# EAGLE design OSO-MISC-20-030 PyRadio (EAGLE 9.6.2)
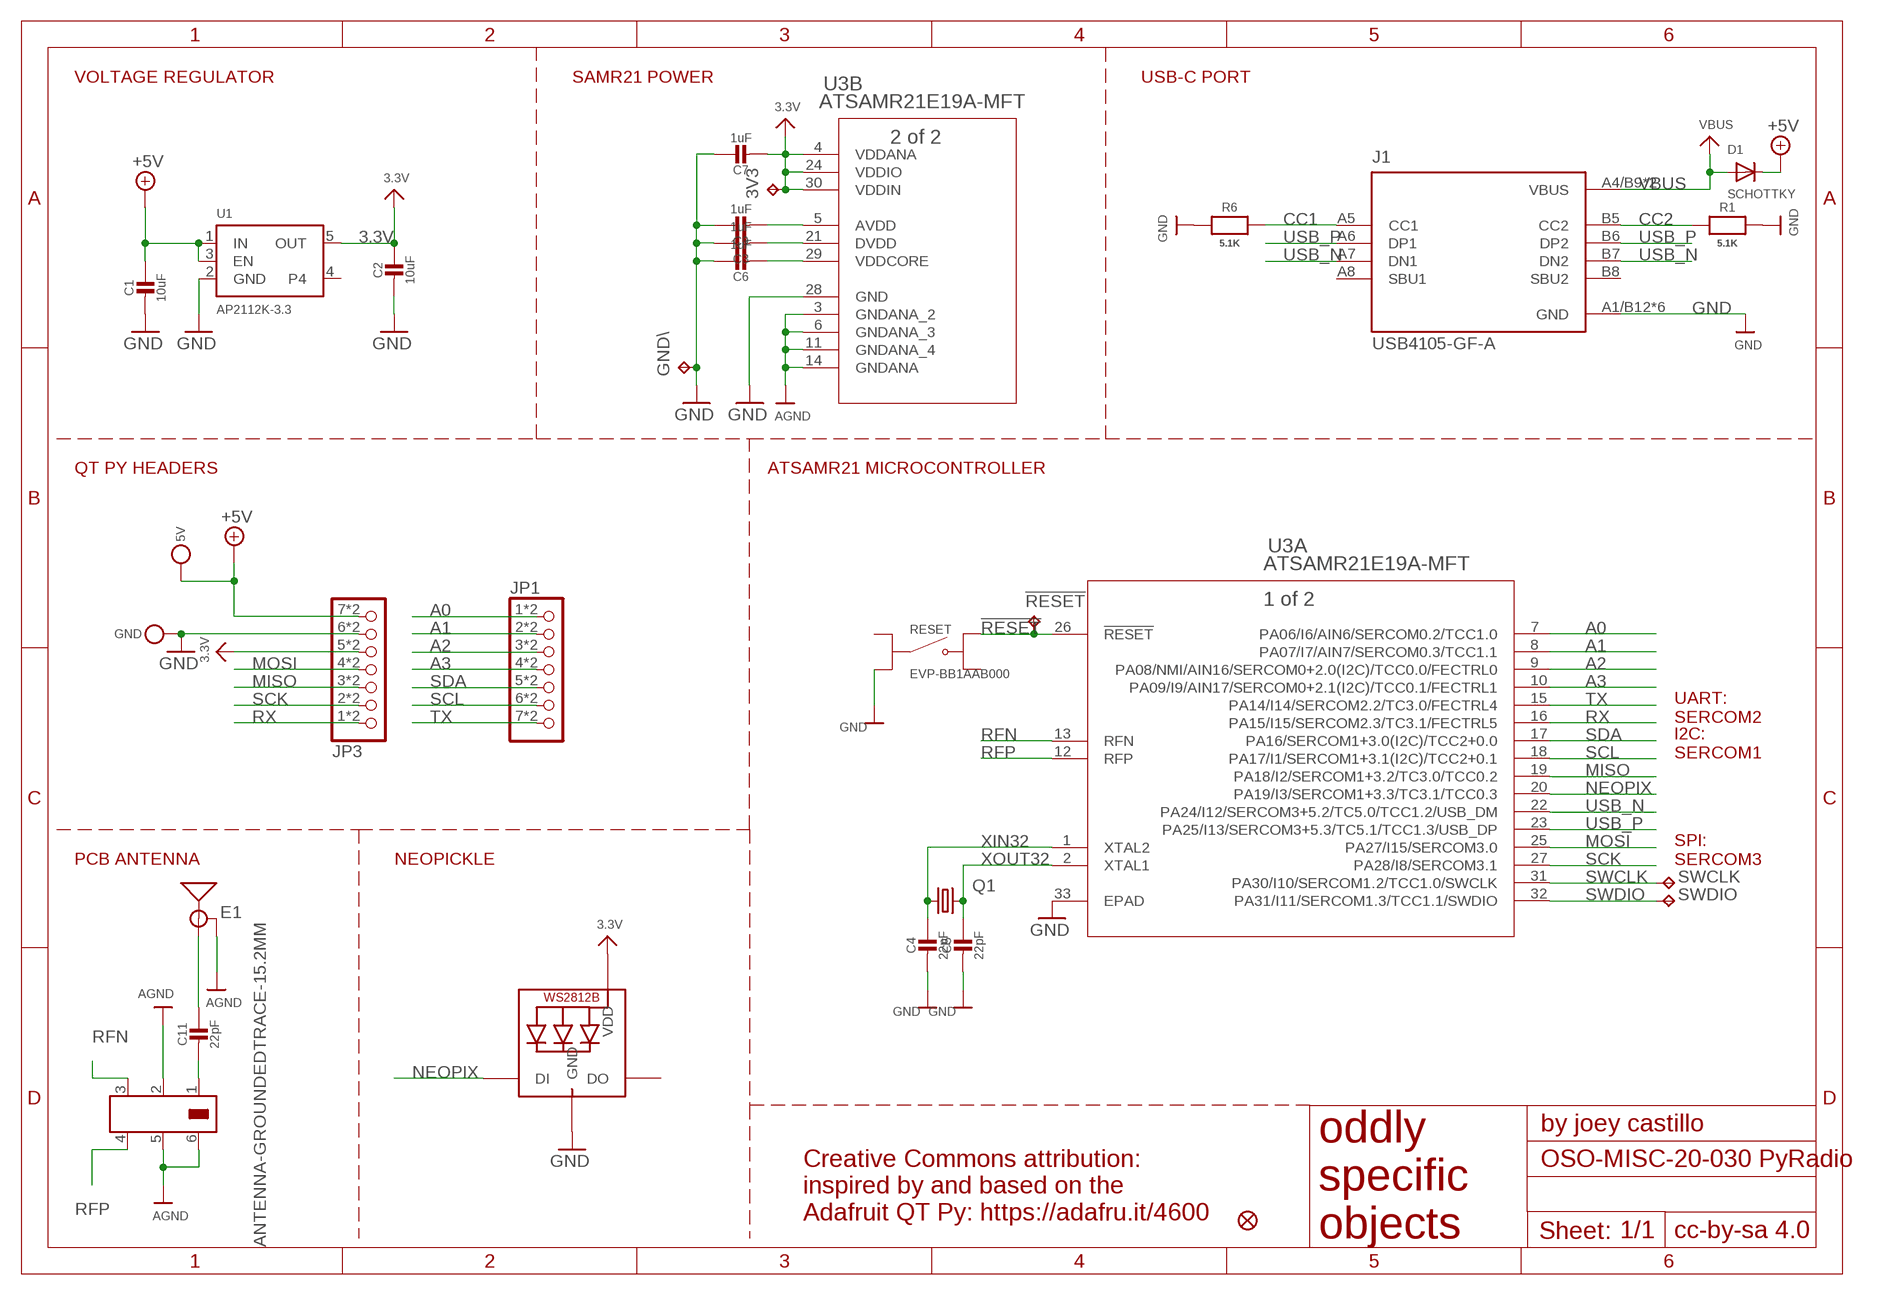
[diagram p0: schematic, sheet 1]

## Parts
3V3  TPTP20R  [TP20R]
5V  TESTPOINT_1X3  [TESTPOINT_RECT_1X3MM]
!RESET  TPTP20R  [TP20R]
BALUN  JOHANSON_2450BM15A0015E  [0805_BALUN]
C1  10uF  CAP_CERAMIC_0603MP  [_0603MP]
C2  10uF  CAP_CERAMIC_0603MP  [_0603MP]
C3  1uF  CAP_CERAMIC_0603MP  [_0603MP]
C4  22pF  CAP_CERAMIC_0603MP  [_0603MP]
C5  22pF  CAP_CERAMIC_0603MP  [_0603MP]
C6  1uF  CAP_CERAMIC_0603MP  [_0603MP]
C7  1uF  CAP_CERAMIC_0603MP  [_0603MP]
C9  1uF  CAP_CERAMIC_0603MP  [_0603MP]
C11  22pF  CAP_CERAMIC_0603MP  [_0603MP]
D1  SCHOTTKY  DIODESOD-323F  [SOD-323F]
E1  ANTENNA-GROUNDEDTRACE-15.2MM  [TRACE_ANTENNA_2.4GHZ_15.2MM]
GND  TESTPOINT_1X3  [TESTPOINT_RECT_1X3MM]
GND\  TPTP20R  [TP20R]
J1  USB4105-GF-A  [GCT_USB4105-GF-A]
JP1  HEADER-1X7_CASTEL  [1X07_CASTEL]
JP3  HEADER-1X7_CASTEL  [1X07_CASTEL]
LED  WS2812B_SK6805_1515  [SK6805_1515]
Q1  KX-7  [3.2X2.5_KX-7]
R1  5.1K  RESISTOR_0603MP  [_0603MP]
R6  5.1K  RESISTOR_0603MP  [_0603MP]
RESET  EVP-BB1AAB000  [SW_EVP-BB1AAB000]
SWCLK  TPTP20R  [TP20R]
SWDIO  TPTP20R  [TP20R]
U1  AP2112K-3.3  VREG_SOT23-5  [SOT23-5]
U3  ATSAMR21E19A-MFT  [QFN32_5X5MC_MCH]
U$8  FIDUCIAL_1MM  [FIDUCIAL_1MM]

## Nets
3.3V [power]: 3V3.TP C2.1 C7.2 JP3.5 JP3.5C LED.2(VDD) U1.5(OUT) U3.4(B:VDDANA) U3.24(B:VDDIO) U3.30(B:VDDIN)
!RESET: !RESET.TP RESET.B1 U3.26(A:!RESET)
+5V [power]: 5V.P$1 C1.1 D1.C JP3.7 JP3.7C U1.1(IN) U1.3(EN)
A0: JP1.1 JP1.1C U3.7(A:PA06/I6/AIN6/SERCOM0.2/TCC1.0)
A1: JP1.2 JP1.2C U3.8(A:PA07/I7/AIN7/SERCOM0.3/TCC1.1)
A2: JP1.3 JP1.3C U3.9(A:PA08/NMI/AIN16/SERCOM0+2.0(I2C)/TCC0.0/FECTRL0)
A3: JP1.4 JP1.4C U3.10(A:PA09/I9/AIN17/SERCOM0+2.1(I2C)/TCC0.1/FECTRL1)
AGND: BALUN.2 BALUN.5 BALUN.6 E1.GND U3.3(B:GNDANA_2) U3.6(B:GNDANA_3) U3.11(B:GNDANA_4) U3.14(B:GNDANA)
ANT_OUT: BALUN.1 C11.2
AVDD [power]: C9.2 U3.5(B:AVDD)
CC1: J1.A5(CC1) R6.2
CC2: J1.B5(CC2) R1.1
DVDD: C3.2 U3.21(B:DVDD)
GND [power]: C1.2 C2.2 C3.1 C4.2 C5.2 C6.1 C7.1 C9.1 GND.P$1 GND\.TP J1.A1/B12(GND) J1.B1/A12(GND) J1.G1(GND) J1.G2(GND) J1.G3(GND) J1.G4(GND) JP3.6 JP3.6C LED.4(GND) R1.2 R6.1 RESET.A2 U1.2(GND) U3.28(B:GND) U3.33(A:EPAD)
MISO: JP3.3 JP3.3C U3.19(A:PA18/I2/SERCOM1+3.2/TC3.0/TCC0.2)
MOSI: JP3.4 JP3.4C U3.25(A:PA27/I15/SERCOM3.0)
NEOPIX: LED.1(DI) U3.20(A:PA19/I3/SERCOM1+3.3/TC3.1/TCC0.3)
PCB_ANT: C11.1 E1.ANT(SIGNAL)
RFN: BALUN.3 U3.13(A:RFN)
RFP: BALUN.4 U3.12(A:RFP)
RX: JP3.1 JP3.1C U3.16(A:PA15/I15/SERCOM2.3/TC3.1/FECTRL5)
SCK: JP3.2 JP3.2C U3.27(A:PA28/I8/SERCOM3.1)
SCL: JP1.6 JP1.6C U3.18(A:PA17/I1/SERCOM1+3.1(I2C)/TCC2+0.1)
SDA: JP1.5 JP1.5C U3.17(A:PA16/SERCOM1+3.0(I2C)/TCC2+0.0)
SWCLK: SWCLK.TP U3.31(A:PA30/I10/SERCOM1.2/TCC1.0/SWCLK)
SWDIO: SWDIO.TP U3.32(A:PA31/I11/SERCOM1.3/TCC1.1/SWDIO)
TX: JP1.7 JP1.7C U3.15(A:PA14/I14/SERCOM2.2/TC3.0/FECTRL4)
USB_N: J1.A7(DN1) J1.B7(DN2) U3.22(A:PA24/I12/SERCOM3+5.2/TC5.0/TCC1.2/USB_DM)
USB_P: J1.A6(DP1) J1.B6(DP2) U3.23(A:PA25/I13/SERCOM3+5.3/TC5.1/TCC1.3/USB_DP)
VBUS [power]: D1.A J1.A4/B9(VBUS) J1.B4/A9(VBUS)
VDDCORE: C6.2 U3.29(B:VDDCORE)
XIN32: C4.1 Q1.1 U3.1(A:XTAL2)
XOUT32: C5.1 Q1.3 U3.2(A:XTAL1)
Unconnected: J1.A8(SBU1) J1.B8(SBU2) LED.3(DO) RESET.A1 RESET.B2 U1.4

## Notes on the sheet
- VOLTAGE REGULATOR | SAMR21 POWER | USB-C PORT
- QT PY HEADERS | ATSAMR21 MICROCONTROLLER
- UART:
  SERCOM2
- I2C:
  SERCOM1
- PCB ANTENNA | NEOPICKLE
- SPI:
  SERCOM3
- Creative Commons attribution:
  inspired by and based on the 
  Adafruit QT Py: https://adafru.it/4600

## Library data of the parts
3V3 !RESET GND\ SWCLK SWDIO = testpad:TP: Test pad
5V GND = microbuilder:TESTPOINT: Test Point Various test points for characterisation and PCB testing TESTPOINT_SMT - Compact Surface Mount Test Point [Digikey: 5016KTR-ND]
BALUN = balun:JOHANSON_2450BM15A0015E
C1-C7 C9 C11 = microbuilder:CAP_CERAMIC: Ceramic Capacitors For new designs, use the packages preceded by an '_' character since they are more reliable: The following footprints should be used on most boards: _0402 - Standard footprint for regular board layouts _0603 - Standard footprint for regular board layouts _0805 - Standard footprint for regular board layouts _1206 - Standard footprint for regular board layouts For extremely tight-pitch boards where space is at a premium, the following 'micro-pitch' footprints can be used (smaller pads, no silkscreen outline, etc.): _0402MP - Micro-pitch footprint for very dense/compact boards _0603MP - Micro-pitch footprint for very dense/compact boards _0805MP - Micro-pitch footprint for very dense/compact boards _1206MP - Micro-pitch footprint for very dense/compact boards
D1 = adafruit:DIODE: Diode SMADIODE - SMA Surface Mount Package 20V 1A Schottky Diode Digikey: 641-1014-6-ND DO-1N4148 - Through Hole Small Current Diode SOD-123 20V 1 A (.5mV Vf) Schottky Diode - Digikey: MBRX120TPMSCT-ND SOD-323 10V 570mA (.38mV Vf, 3ns) Schottky Diode - Digikey: ZLLS410CT-ND SOD-523 30V 30mA Schottky Diode (RB751S-40TE61) - Digikey: RB751S-40TE61CT-ND SOT23-R/W - SOT23 Package (R = Solder Paste/Reflow Ovens, W = Hand-Soldering) BAT54Film 40V 300mA - Digikey: 497-7162-1-ND
E1 = SparkFun-RF:ANTENNA-GROUNDED: Antenna w/ Ground Connection 2.4GHz antennae with signal and ground terminals. TRACE_ANTENNA_2.4GHZ_15.2MM - Meander Trace antenna 15.2 x 5.7mm footprint Based on layout from TI app note AN043 <http://www.ti.com/lit/an/swra117d/swra117d.pdf>. TRACE_ANTENNA_2.4GHZ_25.7MM - Inverted F trace antenna 25.7 x 7.5 mm footprint. Based on layout from TI design note DN0007 <http://www.ti.com/lit/an/swru120b/swru120b.pdf>.
J1 = USB4105-GF-A:USB4105-GF-A: USB Type C Receptacle for USB 2.0 SMT Type, PCB Top Mount; DESCRIPTION: USB-C (USB TYPE-C) USB 2.0 Receptacle Connector 24 (16+8 Dummy) Position Surface Mount, Right Angle; Through Hole; MF: GCT; MP: USB4105-GF-A; PACKAGE: None; PURCHASE-URL: https://pricing.snapeda.com/search/part/USB4105-GF-A/?ref=eda
JP1 JP3 = microbuilder:HEADER-1X7: PIN HEADER
LED = microbuilder:WS2812B
Q1 = crystal-geyer_V1_0:KX: Quartz Crystals (MHz) SMD: KX - Serie Model Size l/w/h [mm] Frequency Range Frequency Stability Temp. Range [°C] Load Capacitance AECQ 200 availabel Datasheet KX-4 KX-5 KX-6 KX-7 KX-9A KX-9B KX-12A KX-12B KX-13 KX-20 KX-K KX-KS 1.6/1.2/0.3 2.0/1.6/0.45 2.5/2.0/0.55 3.2/2.5/0.8 5.0/3.2/1.0 5.0/3.2/1.1 6.0/3.5/1.1 6.0/3.5/1.0 7.0/5.0 /1.3 11.6/5.5/1.6 12.3/4.5/4.2 12.3/4.5/3.2 24.0 ~ 80.0 MHz 16.0 ~ 80.0 MHz 12.0 ~ 80.0 MHz 8.0 ~ 60.0 MHz 7,68 ~ 300,0 MHz 8,0 ~ 50,0 MHz 8,0 ~ 150,0 MHz 8,0 ~ 50,0 MHz 6,0 ~ 160,0 MHz 3,579 ~ 25,0 MHz 3,579 ~ 70,0 MHz 3,579 ~ 70,0 MHz ±10 … ±50ppm ±10 … ±50ppm ±10 … ±50ppm ±10 … ±50ppm ±10 … ±50ppm ±10 … ±50ppm ±10 … ±50ppm ±10 … ±50ppm ±10 … ±50ppm ±50ppm ±10 … ±50ppm ±10 … ±50ppm (*) -40°C …+85°C (*) -40°C …+125°C (*) -40°C …+125°C (*) -40°C …+125°C (*) -40°C …+105°C (*) -40°C …+105°C (*) -40°C …+125°C (*) -40°C …+105°C (*) -40°C …+105°C (*) -40°C …+105°C (*) -40°C …+85°C (*) -40°C …+85°C 8, 8…16 8, 8…16 10, 8…16 12, 7…20 16, 10…20 16, 10…20 16, 10…20 16, 12…20 16, 12…20 16, 12…20 16, 12…30 16, 12…30 - yes yes yes - - - - - - - - KX-4.pdf <http://www.geyer-electronic.de/uploads/tx_userartikelfrequenz/GEYER-KX-4.pdf> KX-5.pdf <http://www.geyer-electronic.de/uploads/tx_userartikelfrequenz/GEYER-KX-5.pdf> KX-6.pdf <http://www.geyer-electronic.de/uploads/tx_userartikelfrequenz/GEYER-KX-6.pdf> KX-7.pdf <http://www.geyer-electronic.de/uploads/tx_userartikelfrequenz/GEYER-KX-7.pdf> KX-9A.pdf <http://www.geyer-electronic.de/uploads/tx_userartikelfrequenz/GEYER-KX-9A.pdf> KX-9B.pdf <http://www.geyer-electronic.de/uploads/tx_userartikelfrequenz/GEYER-KX-9B.pdf> KX-12A.pdf <http://www.geyer-electronic.de/uploads/tx_userartikelfrequenz/GEYER-KX-12A.pdf> KX-12B.pdf <http://www.geyer-electronic.de/uploads/tx_userartikelfrequenz/GEYER-KX-12B.pdf> KX-13.pdf <http://www.geyer-electronic.de/uploads/tx_userartikelfrequenz/GEYER-KX-13.pdf> KX-20.pdf <http://www.geyer-electronic.de/uploads/tx_userartikelfrequenz/GEYER-KX-20.pdf> KX-K.pdf <http://www.geyer-electronic.de/uploads/tx_userartikelfrequenz/GEYER-KX-K.pdf> KX-KS.pdf <http://www.geyer-electronic.de/uploads/tx_userartikelfrequenz/GEYER-KX-KS.pdf> <http://www.geyer-electronic.de/fileadmin/template/img/logo-geyer-electronic.png> Details see: http://www.geyer-electronic.de/Frequenz-Produkte.9.0.html Created 2016-06-07, Hans Locher 2016 (C) Geyer Quartz Technology KX4,KX5,KX6,KX7,KX9A,KX9B,KX12A,KX12B,KX13,KX20,KXK,KXKS;1612;2016;2520;3225;5032;6035;7050;11655;12345;1,6x1,2;2,0x1,6;2,5x2,0;3,2x2,5;5,0x3,2;6,0x3,5;7,0x5,0;11,6x5,5;12,3x4,5;12,3x4,5;1.6x1.2;2.0x1.6;2.5x2.0;3.2x2.5;5.0x3.2;6.0x3.5;7.0x5.0;11.6x5.5;12.3x4.5;12.3x4.5;
R1 R6 = microbuilder:RESISTOR: Resistors For new designs, use the packages preceded by an '_' character since they are more reliable: The following footprints should be used on most boards: _0402 - Standard footprint for regular board layouts _0603 - Standard footprint for regular board layouts _0805 - Standard footprint for regular board layouts _1206 - Standard footprint for regular board layouts For extremely tight-pitch boards where space is at a premium, the following 'micro-pitch' footprints can be used (smaller pads, no silkscreen outline, etc.): _0402MP - Micro-pitch footprint for very dense/compact boards _0603MP - Micro-pitch footprint for very dense/compact boards _0805MP - Micro-pitch footprint for very dense/compact boards _1206MP - Micro-pitch footprint for very dense/compact boards
RESET = EVP-BB1AAB000:EVP-BB1AAB000: SWITCH TACTILE SPST-NO 0.02A 15V; DESCRIPTION: Tactile Switch SPST-NO Top Actuated Surface Mount; DIGI-KEY_PART_NUMBER: P124390CT-ND; MF: Panasonic Electronic Components; MP: EVP-BB1AAB000; PACKAGE: None; PURCHASE-URL: https://pricing.snapeda.com/search/part/EVP-BB1AAB000/?ref=eda
U1 = adafruit_power:VREG_SOT23-5: SOT23-5 Fixed Voltage Regulators Part Current Out V Out V In V Dropout θJA (°C/W) TJ (°C) Digikey Part No. ADP121 150mA 3.3V 3.4-5.5V 0.09V @ 150mA -- -- ADP121-AUJZ33R7CT-ND ADP121 150mA 3.0V 3.1-5.5V 0.09V @ 150mA -- -- ADP121-AUJZ30R7CT-ND ADP122 300mA 3.3V 3.4-5.5V 0.085V @ 300mA -- -- ADP122AUJZ-3.3-R7CT-ND ADP1712 300mA 3.3V 3.5-5.5V 0.17V @ 300mA -- -- ADP1712AUJZ-3.3-R7TR-ND AP7311 (Low Cost) 150mA 3.3V 3.5-6V 0.15V @ 150mA -- -- AP7311-33WG-7DICT-ND LD39015M18R 150mA 1.8V 1.9V-5.5V 0.08V @ 100mA -- -- 497-6977-1-ND LP2985A-33DBVR 150mA 3.3V 3.3-16V 0.28V @ 150mA 206 150 296-18479-1-ND MCP1824T-3302E/OT 300mA 3.3V 3.5V-6V 0.2V @ 300mA -- -- MCP1824T-3302E/OTCT-ND MIC5205-2.5YM5 TR 150mA 2.5V 2.7-16V 0.165V @ 150mA -- -- 576-1257-2-ND MIC5205-3.0YM5 TR 150mA 3.0V 3.2V-16V 0.165V @ 150mA -- -- 576-1258-2-ND MIC5205-3.3YM5 TR 150mA 3.3V 3.5V-16V 0.165V @ 150mA -- -- 576-1259-2-ND TPS780330220 150mA 3.3V+2.2V 3.6-5.5V 250mV Max -- -- 296-23332-1-ND TDA3663/N1,135 100mA 3.3V 3.5-45V 0.18V @ 50mA -- -- 568-5343-1-ND Max operating temp can be calculated using θJA, TJ (max junction temperature), and power in watts. Set the "Maximum Ambient Temperature" until it reaches TJ ("Max Junction Temperature"), which is the absolute limit for safe use of the regulator: Heat Sink Temperature Calculator <http://www.daycounter.com/Calculators/Heat-Sink-Temperature-Calculator.phtml> For example, With 12V source into a 3.3V LP2985 and a 30mA load, we are dissipating (12V-3.3V) * 0.03A = 0.261W. With a θJA of 206 °C/W, a TJ of 150°C, and 261mW we can safely use the chip without a heat sink up to 75°C (=147.1°C Junction Temperature).
U3 = ATSAMR21E19A:ATSAMR21E19A-MFT; BUILT_BY: EMA_Molly; COPYRIGHT: Copyright (C) 2018 Accelerated Designs. All rights reserved; MANUFACTURER_PART_NUMBER: ATSAMR21E19A-MFT; SOURCELIBRARY: Microchip_2019-08-23_25; VENDOR: Microchip
U$8 = microbuilder:FIDUCIAL: Fiducial Alignment Points Various fiducial points for machine vision alignment.; BOM: EXCLUDE

## Net classes
1 power: width 0.254 mm
2 gnd: width 0.254 mm

## Board
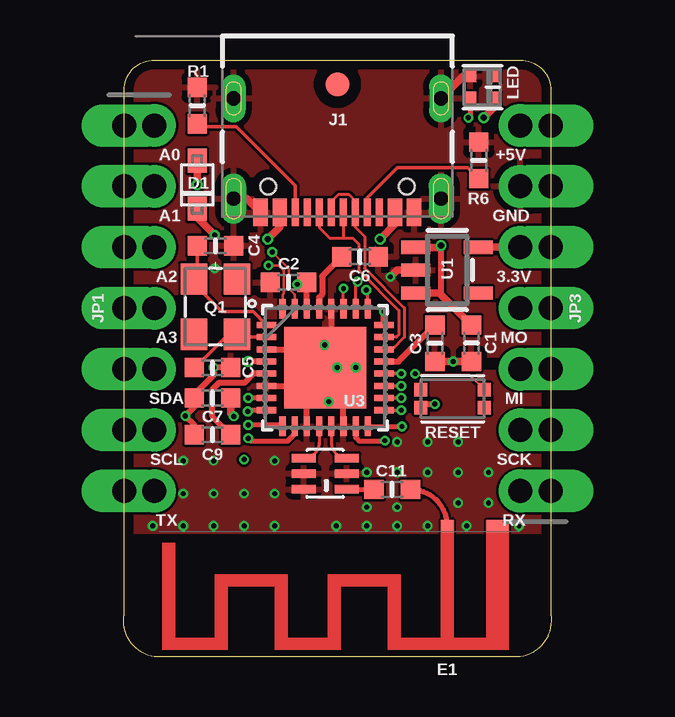
[diagram p1: board, top side]
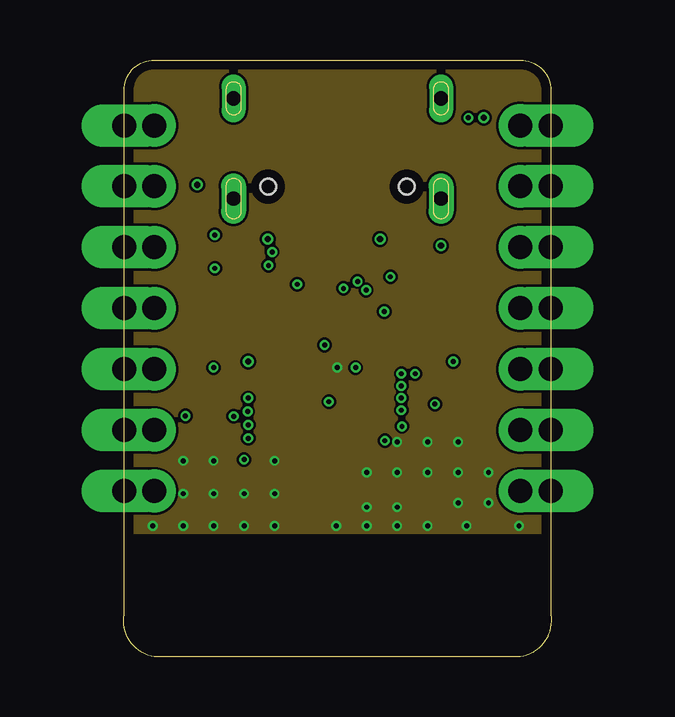
[diagram p2: board, inner layer Route2]
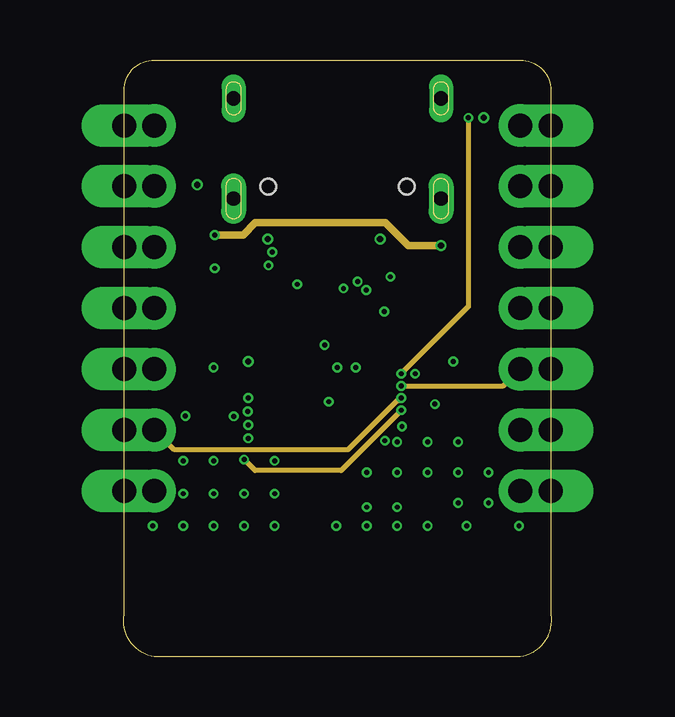
[diagram p3: board, inner layer Route3]
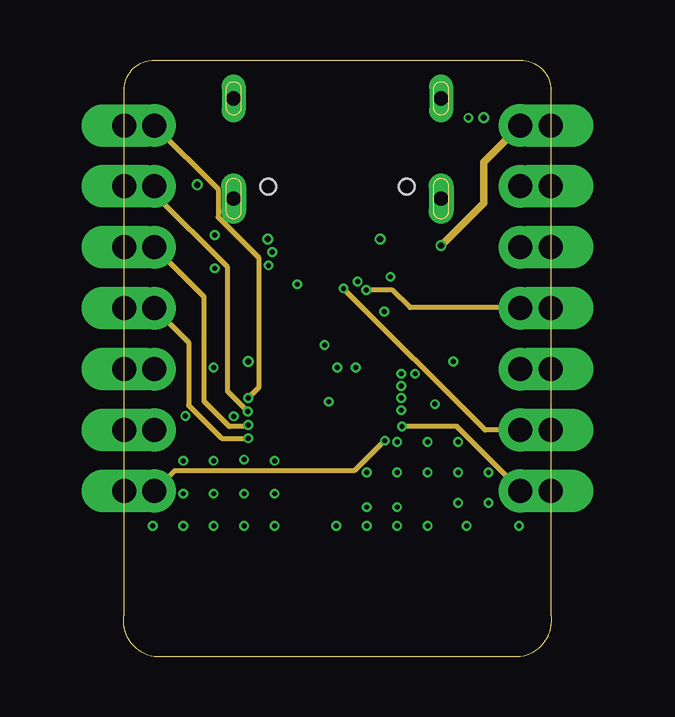
[diagram p4: board, inner layer Route14]
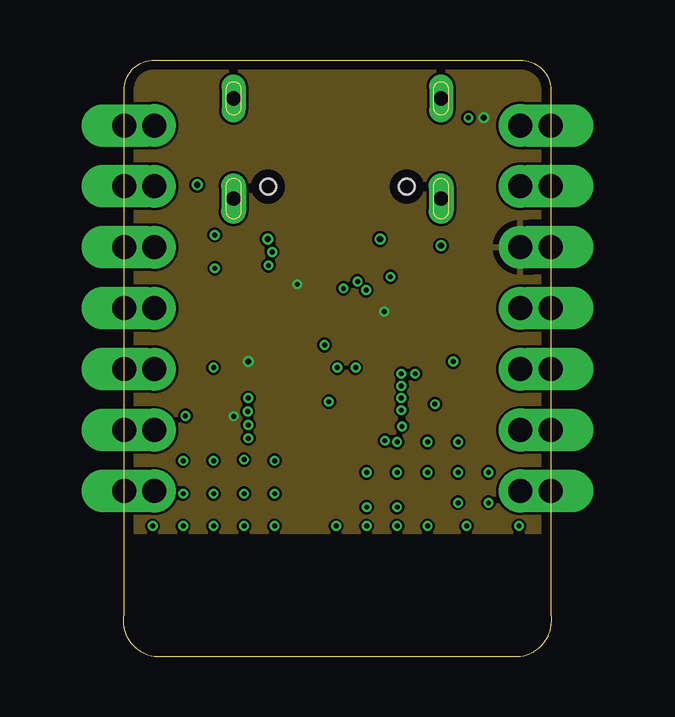
[diagram p5: board, inner layer Route15]
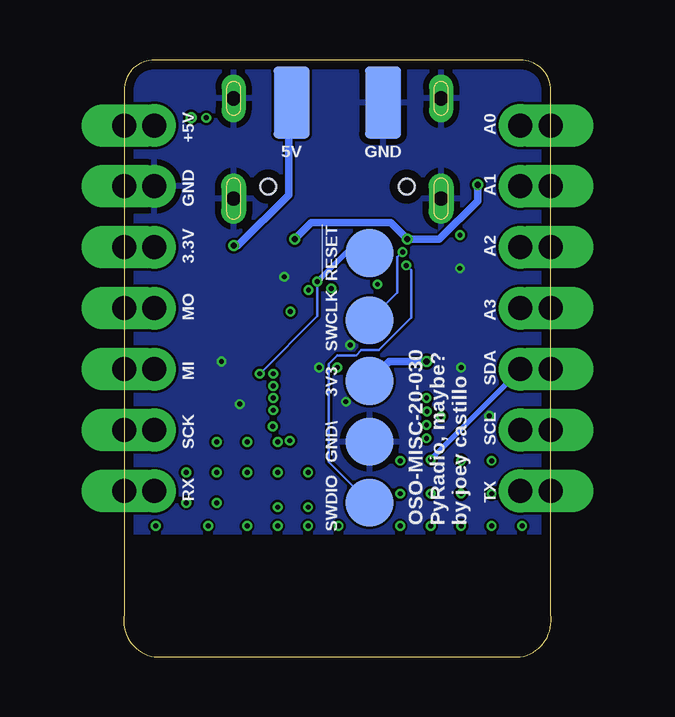
[diagram p6: board, bottom side, seen from below]

Size 17.82 x 24.89 mm. Coordinates in mm from the lower left corner, seen from the top.
Outline: 17.8,23.62 17.8,1.78 arc-90 16.53,0 1.29,0 arc-90 0.02,1.78 0.02,23.62 arc-90 1.29,24.89 16.53,24.89 arc-90 17.8,23.62
Copper layers (1+2*3+14*15+16): Top 0.04571875mm / dielectric 0.11074375mm / Route2 0.015240625mm / dielectric 4mil / Route3 0.015240625mm / dielectric 0.696975mm / Route14 0.015240625mm / dielectric 4mil / Route15 0.015240625mm / dielectric 0.11074375mm / Bottom 0.04571875mm
Design rules "oshpark-6layer-tentative": minimum track width 4mil, minimum drill 8mil, track to track 4mil, track to pad 4mil, pad to pad 4mil, via to via 4mil, smd to smd 4mil, copper to edge 15mil, drill to drill 6mil, minimum pad ring 4mil, minimum via ring 4mil, stop-mask expansion 1.5mil, vias tented up to drill 10mil, thermal gap 10mil

### Footprints (pad centres in the part's own frame; a part is rotated, then mirrored left to right if it is on the bottom)
TP20R = smd 2 x 2: TP 0,0
TESTPOINT_RECT_1X3MM = smd 3 x 1.5: P$1 0,0
0805_BALUN = smd 1 x 0.35: 1 -0.9,0.65; 2 -0.9,0; 3 -0.9,-0.65; 4 0.9,-0.65; 5 0.9,0; 6 0.9,0.65
_0603MP = smd 0.8 x 0.8: 1 -0.762,0; 2 0.762,0
SOD-323F = smd 1 x 0.8: A -1,0; C 1,0
TRACE_ANTENNA_2.4GHZ_15.2MM = smd 0.5 x 0.5: ANT 0,-0.25 | smd 0.9 x 0.5: GND -2.1,-0.25
GCT_USB4105-GF-A = smd 0.6 x 1.15: A1/B12 -3.2,4.755; A4/B9 -2.4,4.755; B1/A12 3.2,4.755; B4/A9 2.4,4.755 | smd 0.3 x 1.15: A5 -1.25,4.755; A6 -0.25,4.755; A7 0.25,4.755; A8 1.25,4.755; B5 1.75,4.755; B6 0.75,4.755; B7 -0.75,4.755; B8 -1.75,4.755 | drill 0.6 pad 1 long: G1 -4.32,0; G2 4.32,0 | drill 0.6 pad 1.05 long: G3 -4.32,4.18; G4 4.32,4.18 | hole 0.65: 2.89,3.68; -2.89,3.68
1X07_CASTEL = drill 1 pad 1.778: 1 -7.62,0; 2 -5.08,0; 3 -2.54,0; 4 0,0; 5 2.54,0; 6 5.08,0; 7 7.62,0 | drill 1 pad 1.778 long: 1C -7.62,-1.27; 2C -5.08,-1.27; 3C -2.54,-1.27; 4C 0,-1.27; 5C 2.54,-1.27; 6C 5.08,-1.27; 7C 7.62,-1.27
SK6805_1515 = smd 0.5 x 0.5: 1 -0.5,-0.45; 2 0.5,-0.45; 3 0.5,0.45; 4 -0.5,0.45
3.2X2.5_KX-7 = smd 1.3 x 1.1: 1 -1.15,-0.9; 2 1.15,-0.9; 3 1.15,0.9; 4 -1.15,0.9
SW_EVP-BB1AAB000 = smd 0.55 x 0.55: A1 -1.325,0.375; A2 -1.325,-0.375; B1 1.325,0.375; B2 1.325,-0.375
SOT23-5 = smd 0.55 x 1.2: 1 -0.95,-1.3; 2 0,-1.3; 3 0.95,-1.3; 4 0.95,1.3; 5 -0.95,1.3
QFN32_5X5MC_MCH = smd 0.813 x 0.254: 1 -2.451,1.778; 2 -2.451,1.27; 3 -2.451,0.762; 4 -2.451,0.254; 5 -2.451,-0.254; 6 -2.451,-0.762; 7 -2.451,-1.27; 8 -2.451,-1.778; 17 2.451,-1.778; 18 2.451,-1.27; 19 2.451,-0.762; 20 2.451,-0.254; 21 2.451,0.254; 22 2.451,0.762; 23 2.451,1.27; 24 2.451,1.778 | smd 0.254 x 0.813: 9 -1.778,-2.451; 10 -1.27,-2.451; 11 -0.762,-2.451; 12 -0.254,-2.451; 13 0.254,-2.451; 14 0.762,-2.451; 15 1.27,-2.451; 16 1.778,-2.451; 25 1.778,2.451; 26 1.27,2.451; 27 0.762,2.451; 28 0.254,2.451; 29 -0.254,2.451; 30 -0.762,2.451; 31 -1.27,2.451; 32 -1.778,2.451 | smd 3.404 x 3.404: 33 0,0
FIDUCIAL_1MM = smd 1 x 1: 1 0,0

### Placement (x,y rotation side)
3V3  7.56,11.51 0 bottom
5V  10.82,23.11 270 bottom
!RESET  7.56,16.84 0 bottom
BALUN  8.4,7.65 180 top
C1  14.5,13.08 270 top
C2  6.88,15.62 180 top
C3  12.97,13.08 90 top
C4  3.83,17.14 0 top
C5  3.7,12.06 0 top
C6  9.85,16.69 180 top
C7  3.7,10.79 0 top
C9  3.7,9.27 0 top
C11  11.2,6.98 180 top
D1  3.07,19.68 270 top
E1  13.48,5.21 180 top
GND  7.01,23.11 270 bottom
GND\  7.56,8.97 0 bottom
J1  8.91,23.29 180 top
JP1  1.29,14.54 270 top
JP3  16.53,14.54 90 top
LED  14.96,23.76 0 top
Q1  3.83,14.61 270 top
R1  3.07,22.99 90 top
R6  14.8,20.7 270 top
RESET  13.71,10.77 0 top
SWCLK  7.56,14.05 0 bottom
SWDIO  7.56,6.43 0 bottom
U1  13.48,16.13 270 top
U3  8.4,12.06 0 top
U$8  8.91,23.88 0 top

### Tracks (layer width: path | path; a pad name or v marks a point on that pad's centre or on a via)
3.3V  (via drill 0.2, 0.25)
  Top 0.254: U3.30 C2.1 | U3.4 v5.2,12.32
  Top 0.305: C7.2 4.47,10.16 v4.59,10.03 | JP3.5C U1.5 | LED.2 15.46,22.93 v15.01,22.48 | U3.24 10.85,14.39 v10.87,14.4 | C2.1 7.55,15.54 v7.24,15.54
  Route14 0.305: JP3.5C JP3.5
  Bottom 0.305: 3V3.TP 6.75,12.32 v5.2,12.32
  pour Route15: 0.02,5.21 0.02,24.83 17.8,24.83 17.8,5.21
!RESET  (via drill 0.2)
  Top 0.102: RESET.B1 14.41,11.77 12.19,11.77 v12.15,11.81
  Top 0.127: U3.26 9.67,15.58 v9.75,15.66
  Bottom 0.102: v12.15,11.81 9.75,14.2 v9.75,15.66
  Bottom 0.203: !RESET.TP 8.57,16.84 v9.75,15.66
+5V  (via drill 0.2, 0.25)
  Top 0.254: 13.16,15.18 13.23,15.25 v13.23,17.14
  Top 0.305: D1.C 3.07,18.32 v3.8,17.59 | v13.23,17.14 13.16,17.08 U1.1 | U1.3 13.16,15.18 C1.1
  Route3 0.305: v3.8,17.59 4.99,17.59 5.5,18.1 10.9,18.1 11.86,17.14 v13.23,17.14
  Route14 0.305: JP3.7C JP3.7 15.01,20.64 15.01,18.92 v13.23,17.14
  Bottom 0.305: 5V.P$1 10.94,22.99 10.94,19.26 13.05,17.14 v13.23,17.14
A0  (via drill 0.2)
  Top 0.203: U3.7 v5.2,10.79
  Route14 0.203: v5.2,10.79 5.63,11.23 5.63,16.64 3.94,18.33 3.94,19.52 JP1.1 JP1.1C
A1  (via drill 0.2)
  Top 0.203: U3.8 5.22,10.29 v5.17,10.24
  Route14 0.203: v5.17,10.24 4.34,11.07 4.34,16.26 1.29,19.3 JP1.2 JP1.2C
A2  (via drill 0.2)
  Top 0.203: U3.9 6.56,9.68 v5.2,9.68
  Route14 0.203: v5.2,9.68 5.12,9.6 4.41,9.6 3.35,10.67 3.35,15.02 JP1.3 JP1.3C
A3  (via drill 0.2)
  Top 0.203: U3.10 7.13,9.3 6.84,9 5.31,9 v5.2,9.12
  Route14 0.203: v5.2,9.12 4.08,9.12 2.71,10.49 2.71,13.12 JP1.4 JP1.4C
AGND  (via drill 0.2)
  Top 0.254: U3.14 9.16,11.81 v8.91,12.06 | U3.11 7.64,10.79 | 7.64,10.79 v8.91,12.06 | U3.3 7.39,12.83 8.15,12.06 v8.91,12.06 | U3.6 7.13,11.3 7.64,10.79
  other vias: 2.48,5.46 3.75,5.46 5.02,5.46 6.29,5.46 8.86,5.46 10.13,5.46 11.4,5.46 12.67,5.46 1.21,5.46 10.13,6.25 11.4,6.25 11.4,7.7 10.13,7.7 12.67,7.7 15.21,7.7 13.94,6.43 15.21,6.43 13.94,7.7 13.94,8.97 12.67,8.97 11.4,8.97 14.3,5.46 16.48,5.46 3.75,8.18 2.48,8.18 5.02,6.81 3.75,6.81 2.48,6.81 6.29,6.81 6.29,8.18
  pour Top: 0.02,5.21 0.02,11.87 17.8,11.87 17.8,5.21
  pour Route2: 0.02,5.21 0.02,24.83 17.8,24.83 17.8,5.21
ANT_OUT
  Top 0.216: BALUN.1 10.42,6.99 C11.2
AVDD
  Top 0.254: U3.5 5.44,11.81 5.05,11.42 3.97,11.42 3.7,11.16 3.7,10.03 C9.2
CC1
  Top 0.152: J1.A5 10.16,19.16 11.4,20.39 14.35,20.39 R6.2
CC2
  Top 0.152: J1.B5 7.16,19.66 4.7,22.11 3.18,22.11 R1.1
DVDD
  Top 0.254: U3.21 11.45,12.32 C3.2
GND  (via drill 0.2)
  Top 0.254: U3.28 8.66,13.28 v8.38,13 8.38,12.09 U3.33 | RESET.A2 12.53,10.54 v12.97,10.54 | C9.1 2.94,9.69 v2.58,10.05 2.94,10.41 C7.1 2.94,10.94 3.75,11.75 v3.75,12.06 C5.2
  Top 0.305: U1.2 11.4,16.13 v11.12,15.85 | C3.1 v13.74,12.32 C1.2 | J1.B1/A12 5.14,19.11 J1.G4 | LED.4 14.15,24.21 J1.G1
  Route14 0.305: JP3.6C JP3.6
  other vias: 9.67,12.06 3.81,16.21 8.56,10.64
  pour Top: 0.02,12.57 0.02,24.83 17.8,24.83 17.8,12.57
  pour Bottom: 0.02,5.21 0.02,24.83 17.8,24.83 17.8,5.21
MISO  (via drill 0.2)
  Top 0.152: U3.19 v11.58,11.3
  Route3 0.203: v11.58,11.3 15.83,11.3 JP3.3
  Route14 0.203: JP3.3C JP3.3
MOSI  (via drill 0.2)
  Top 0.127: U3.25 10.18,15.23 v10.11,15.3
  Route14 0.203: v10.11,15.3 11.2,15.3 11.94,14.56 16.51,14.56 JP3.4 JP3.4C
NEOPIX  (via drill 0.2)
  Top 0.152: U3.20 v11.58,11.81
  Top 0.203: LED.1 14.46,22.56 v14.37,22.48
  Route3 0.203: v14.37,22.48 14.37,14.61 v11.58,11.81
PCB_ANT
  Top 0.216: C11.1 arc-90 E1.ANT
RFN
  Top 0.127: U3.13 8.66,8.94 arc90 BALUN.3
RFP
  Top 0.127: U3.12 8.15,8.94 arc-90 BALUN.4
RX  (via drill 0.2)
  Top 0.203: U3.16 v11.6,9.61
  Route14 0.203: v11.6,9.61 13.89,9.61 16.53,6.97 JP3.1 JP3.1C
SCK  (via drill 0.2)
  Top 0.127: U3.27 v9.16,15.37
  Route14 0.203: v9.16,15.37 15.07,9.46 JP3.2 JP3.2C
SCL  (via drill 0.2)
  Top 0.152: U3.18 v11.58,10.79
  Route3 0.203: v11.58,10.79 11.48,10.69 11.41,10.69 9.35,8.64 2.12,8.64 JP1.6
  Route14 0.203: JP1.6C JP1.6
SDA  (via drill 0.2)
  Top 0.152: v11.58,10.29 U3.17
  Route3 0.203: v5.02,8.23 5.48,7.77 9.06,7.77 v11.58,10.29
  Route14 0.203: JP1.5C JP1.5
  Bottom 0.203: v5.02,8.23 1.29,11.96 JP1.5
SWCLK  (via drill 0.2)
  Top 0.102: U3.31 7.13,15.11 6.88,15.36 6.88,16.19 v6.19,16.89
  Bottom 0.102: SWCLK.TP 6.41,15.2 6.41,16.66 v6.19,16.89
SWDIO  (via drill 0.2)
  Top 0.102: U3.32 6.62,15.11 6.67,15.16 6.67,16.1 6.45,16.33 v6.04,16.33
  Bottom 0.102: SWDIO.TP 9.27,8.13 9.27,12.21 8.91,12.57 8.13,12.57 7.91,12.79 7.19,12.79 5.84,14.14 5.84,16.12 v6.04,16.33
TX  (via drill 0.2)
  Top 0.203: U3.15 9.67,9.14 9.82,8.99 10.87,8.99 v10.89,9.02
  Route14 0.203: v10.89,9.02 10.87,9.02 9.61,7.76 2.13,7.76 JP1.7 JP1.7C
USB_N
  Top 0.127: U3.22 11.2,12.83 11.7,13.34 11.7,14.55 10.05,16.21 10.05,17.53 9.66,17.92 J1.B7 9.66,19.02 9.38,19.29 8.96,19.29 8.66,19 J1.A7
USB_P
  Top 0.127: U3.23 11.37,13.34 11.48,13.44 11.48,14.45 9.81,16.12 9.81,17.21 9.56,17.46 9.16,17.46 | J1.A6 9.16,17.46 | J1.B6 8.16,17.89 8.6,17.46 9.16,17.46
VBUS  (via drill 0.25)
  Top 0.305: J1.A4/B9 11.31,18.04 v10.69,17.42 | v3.07,19.68 D1.A | v6,17.42 6.51,17.93 J1.B4/A9
  Bottom 0.305: v10.69,17.42 10,18.1 6.69,18.1 v6,17.42 4.66,17.42 3.07,19.01 v3.07,19.68
VDDCORE
  Top 0.254: U3.29 8.15,14.99 8.28,15.11 8.28,15.88 C6.2
XIN32
  Top 0.152: U3.1 5.4,14.39 4.09,14.39 2.98,15.5 2.98,15.7 Q1.1 3.07,15.89 C4.1
XOUT32
  Top 0.152: U3.2 4.85,13.34 Q1.3 4.38,13.45 2.99,12.06 C5.1

### Text on the board
tPlace: A0 | +5V | A1 | GND | A2 | 3.3V | A3 | MO | SDA | MI | SCL | SCK | TX | RX
bPlace: A0 | +5V | A1 | GND | A2 | 3.3V | A3 | MO | SDA | MI | SCL | SCK | TX | RX | OSO-MISC-20-030 / PyRadio, maybe? / by joey castillo